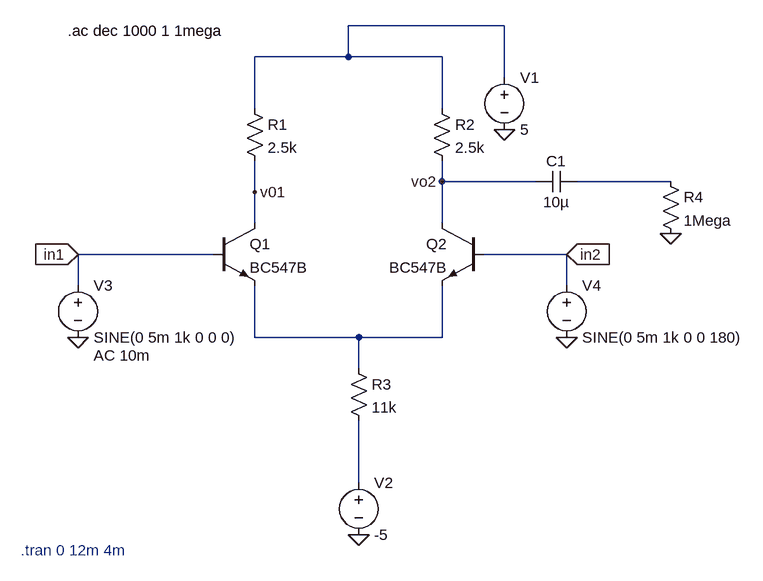
[diagram p0: schematic Differential Circuit Simulation.asc]
Differential Circuit Simulation.asc, the LTspice schematic file:
Version 4.1
SHEET 1 880 808
WIRE 400 -16 160 -16
WIRE 160 32 160 -16
WIRE 160 32 16 32
WIRE 304 32 160 32
WIRE 400 64 400 -16
WIRE 16 112 16 32
WIRE 304 112 304 32
WIRE 304 224 304 192
WIRE 448 224 304 224
WIRE 656 224 512 224
WIRE 16 240 16 192
WIRE 16 288 16 240
WIRE 304 288 304 224
WIRE -48 336 -256 336
WIRE 496 336 368 336
WIRE -256 384 -256 336
WIRE 496 384 496 336
WIRE 16 464 16 384
WIRE 176 464 16 464
WIRE 304 464 304 384
WIRE 304 464 176 464
WIRE 176 512 176 464
WIRE 176 688 176 592
FLAG 400 144 0
FLAG 176 768 0
FLAG -256 464 0
FLAG 496 464 0
FLAG -256 336 in1
IOPIN -256 336 In
FLAG 496 336 in2
IOPIN 496 336 In
FLAG 16 240 v01
FLAG 304 224 vo2
FLAG 656 304 0
SYMBOL npn -48 288 R0
SYMATTR InstName Q1
SYMATTR Value BC547B
SYMBOL npn 368 288 M0
SYMATTR InstName Q2
SYMATTR Value BC547B
SYMBOL res 0 96 R0
SYMATTR InstName R1
SYMATTR Value 2.5k
SYMBOL res 288 96 R0
SYMATTR InstName R2
SYMATTR Value 2.5k
SYMBOL voltage 400 48 R0
WINDOW 123 0 0 Left 0
WINDOW 39 0 0 Left 0
SYMATTR InstName V1
SYMATTR Value 5
SYMBOL cap 512 208 R90
WINDOW 0 0 32 VBottom 2
WINDOW 3 32 32 VTop 2
SYMATTR InstName C1
SYMATTR Value 10µ
SYMBOL res 160 496 R0
SYMATTR InstName R3
SYMATTR Value 11k
SYMBOL voltage 176 672 R0
WINDOW 123 0 0 Left 0
WINDOW 39 0 0 Left 0
SYMATTR InstName V2
SYMATTR Value -5
SYMBOL voltage -256 368 R0
WINDOW 123 24 124 Left 2
WINDOW 39 0 0 Left 0
SYMATTR Value2 AC 10m
SYMATTR InstName V3
SYMATTR Value SINE(0 5m 1k 0 0 0)
SYMBOL voltage 496 368 R0
WINDOW 123 0 0 Left 0
WINDOW 39 0 0 Left 0
SYMATTR InstName V4
SYMATTR Value SINE(0 5m 1k 0 0 180)
SYMBOL res 640 208 R0
SYMATTR InstName R4
SYMATTR Value 1Mega
TEXT -344 792 Left 2 ;.tran 0 12m 4m
TEXT -272 -8 Left 2 !.ac dec 1000 1 1mega

The netlist it stands for:
* Differential Circuit Simulation.asc
Q1 v01 in1 N003 0 BC547B
Q2 vo2 in2 N003 0 BC547B
R1 N001 v01 2.5k
R2 N001 vo2 2.5k
V1 N001 0 5
C1 N002 vo2 10µ
R3 N003 N004 11k
V2 N004 0 -5
V3 in1 0 SINE(0 5m 1k 0 0 0) AC 10m
V4 in2 0 SINE(0 5m 1k 0 0 180)
R4 N002 0 1Mega
.model NPN NPN
.model PNP PNP
.lib standard.bjt
* .tran 0 12m 4m
.ac dec 1000 1 1mega
.backanno
.end